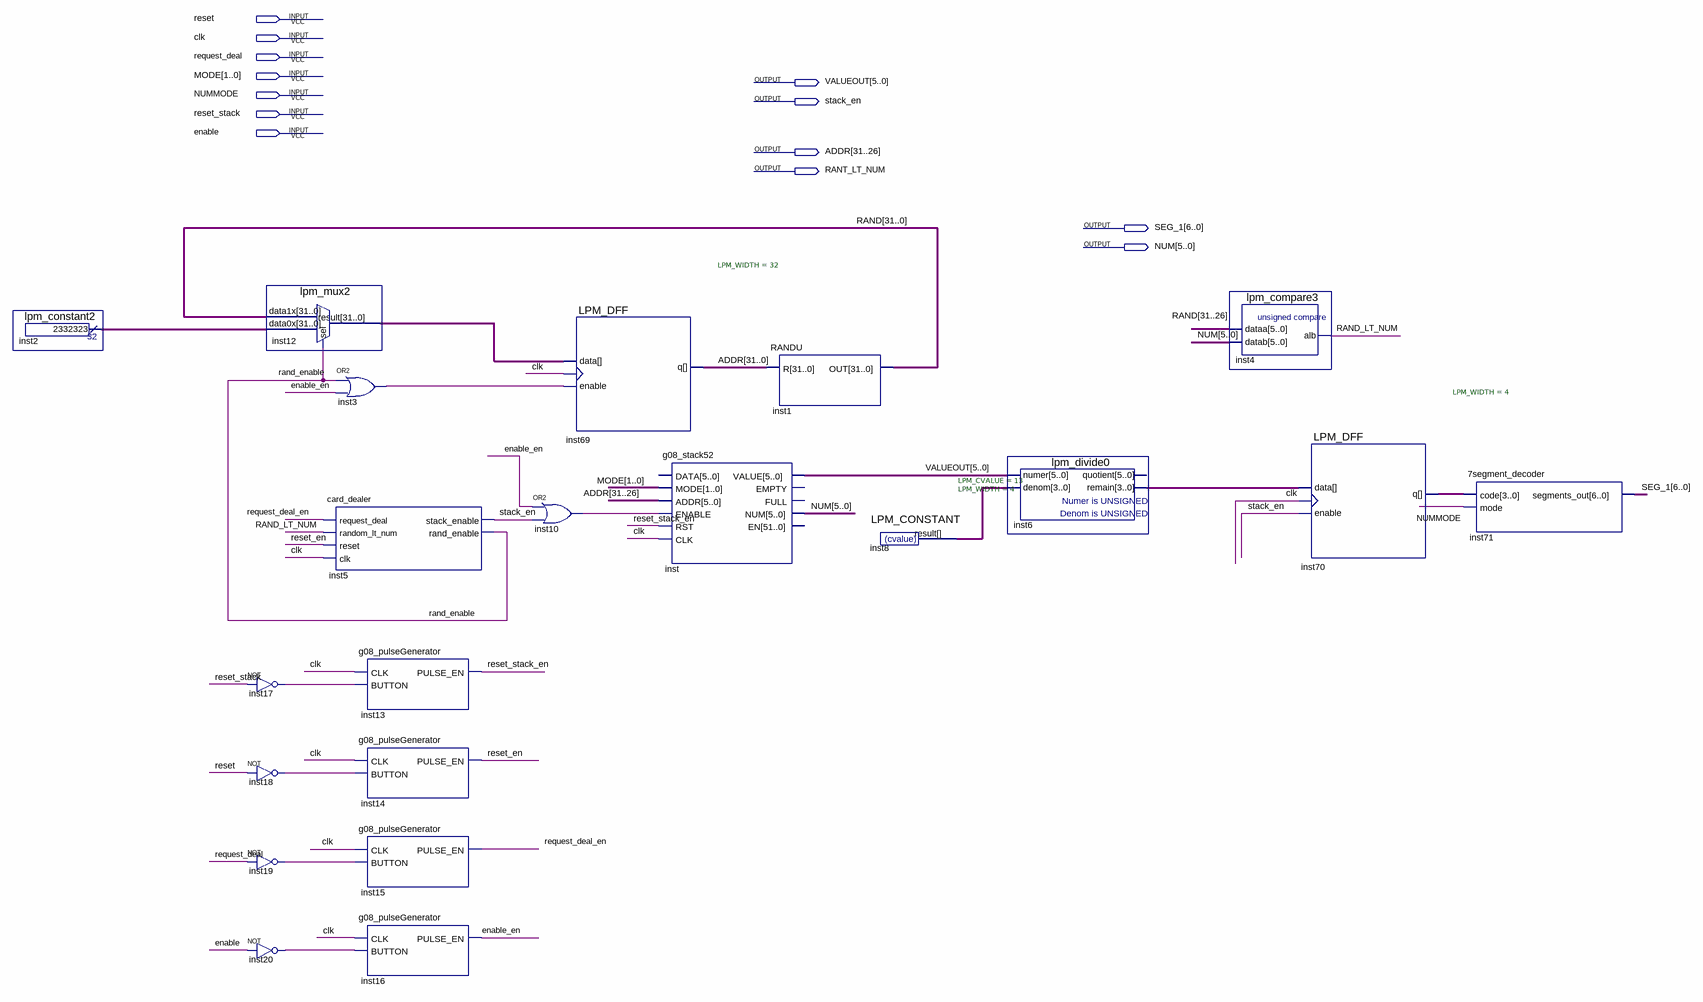
[diagram p0: schematic sheet]
// Quartus schematic test_bed.bdf as structural Verilog: 21 symbols, 13 pins
module test_bed (
  input  reset,
  input  clk,
  input  request_deal,
  input  [1:0] MODE,
  input  NUMMODE,
  input  reset_stack,
  input  enable,
  output [5:0] VALUEOUT,
  output stack_en,
  output [31:0] ADDR,
  output RANT_LT_NUM,
  output [6:0] SEG_1,
  output [5:0] NUM
);

  wire enable_en, inst3_out, inst10_out, inst17_out, inst18_out, inst19_out, inst20_out, rand_enable,
       RAND_LT_NUM, request_deal_en, reset_en, reset_stack_en;
  wire [3:0] inst6_remain, inst8_result, inst70_q;
  wire [31:0] inst2_result, inst12_result, RAND;

  lpm_constant2 inst2 (.result(inst2_result));
  not inst17 (inst17_out, reset_stack);
  not inst18 (inst18_out, reset);
  not inst19 (inst19_out, request_deal);
  not inst20 (inst20_out, enable);
  lpm_mux2 inst12 (.data1x(RAND), .data0x(inst2_result), .sel(rand_enable), .result(inst12_result));
  or inst3 (inst3_out, rand_enable, enable_en);
  card_dealer inst5 (
    .request_deal(request_deal_en), .random_lt_num(RAND_LT_NUM), .reset(reset_en), .clk(clk),
    .stack_enable(stack_en), .rand_enable(rand_enable));
  g08_pulseGenerator inst13 (.CLK(clk), .BUTTON(inst17_out), .PULSE_EN(reset_stack_en));
  g08_pulseGenerator inst14 (.CLK(clk), .BUTTON(inst18_out), .PULSE_EN(reset_en));
  g08_pulseGenerator inst15 (.CLK(clk), .BUTTON(inst19_out), .PULSE_EN(request_deal_en));
  g08_pulseGenerator inst16 (.CLK(clk), .BUTTON(inst20_out), .PULSE_EN(enable_en));
  or inst10 (inst10_out, enable_en, stack_en);
  LPM_DFF #(.LPM_WIDTH(32)) inst69 (.enable(inst3_out), .clock(clk), .data(inst12_result), .q(ADDR));
  g08_stack52 inst (
    .MODE(MODE), .ADDR(ADDR[31:26]), .ENABLE(inst10_out), .RST(reset_stack_en), .CLK(clk), .VALUE(VALUEOUT),
    .NUM(NUM));  // open: DATA, EMPTY, FULL, EN
  RANDU inst1 (.R(ADDR), .OUT(RAND));
  LPM_CONSTANT #(.LPM_CVALUE(13), .LPM_WIDTH(4)) inst8 (.result(inst8_result));
  lpm_divide0 inst6 (.numer(VALUEOUT), .denom(inst8_result), .remain(inst6_remain));  // open: quotient
  lpm_compare3 inst4 (.dataa(RAND[31:26]), .datab(NUM), .alb(RAND_LT_NUM));
  LPM_DFF #(.LPM_WIDTH(4)) inst70 (.enable(stack_en), .clock(clk), .data(inst6_remain), .q(inst70_q));
  \7segment_decoder  inst71 (.code(inst70_q), .mode(NUMMODE), .segments_out(SEG_1));
endmodule
